# EasyEDA Pro project 数控电源.eprj, board 开关电源1号
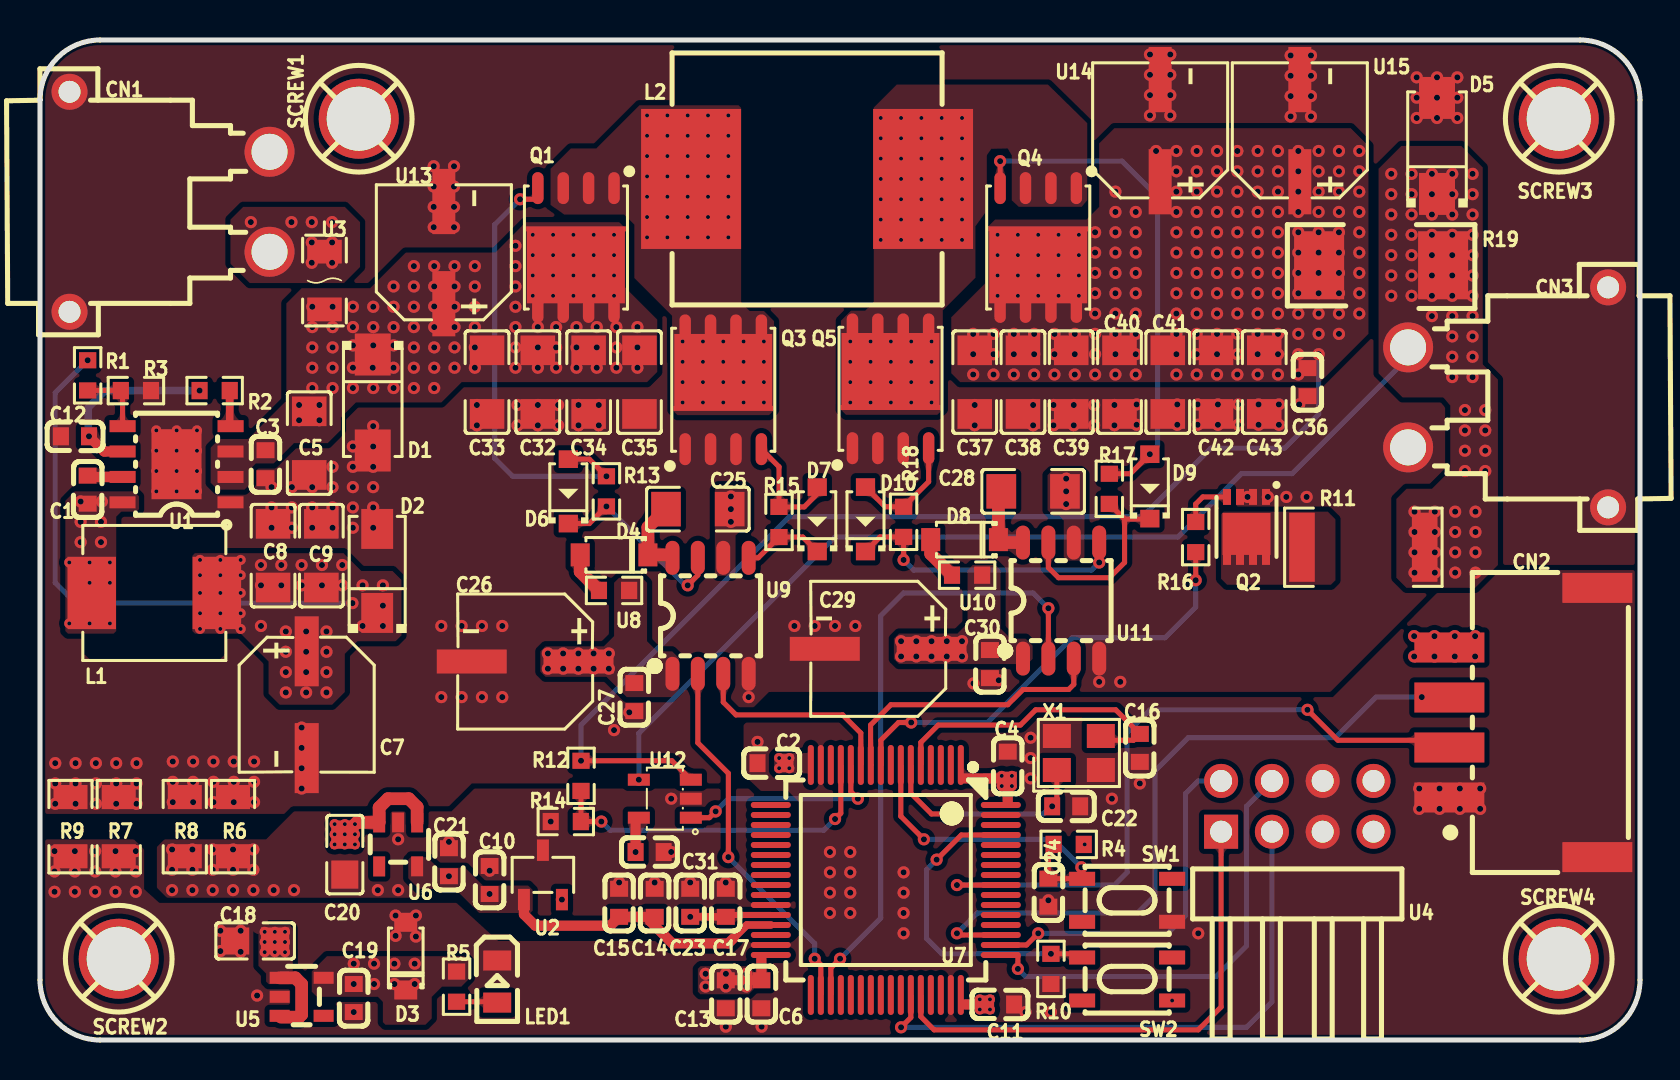
[diagram p2: board, top side]
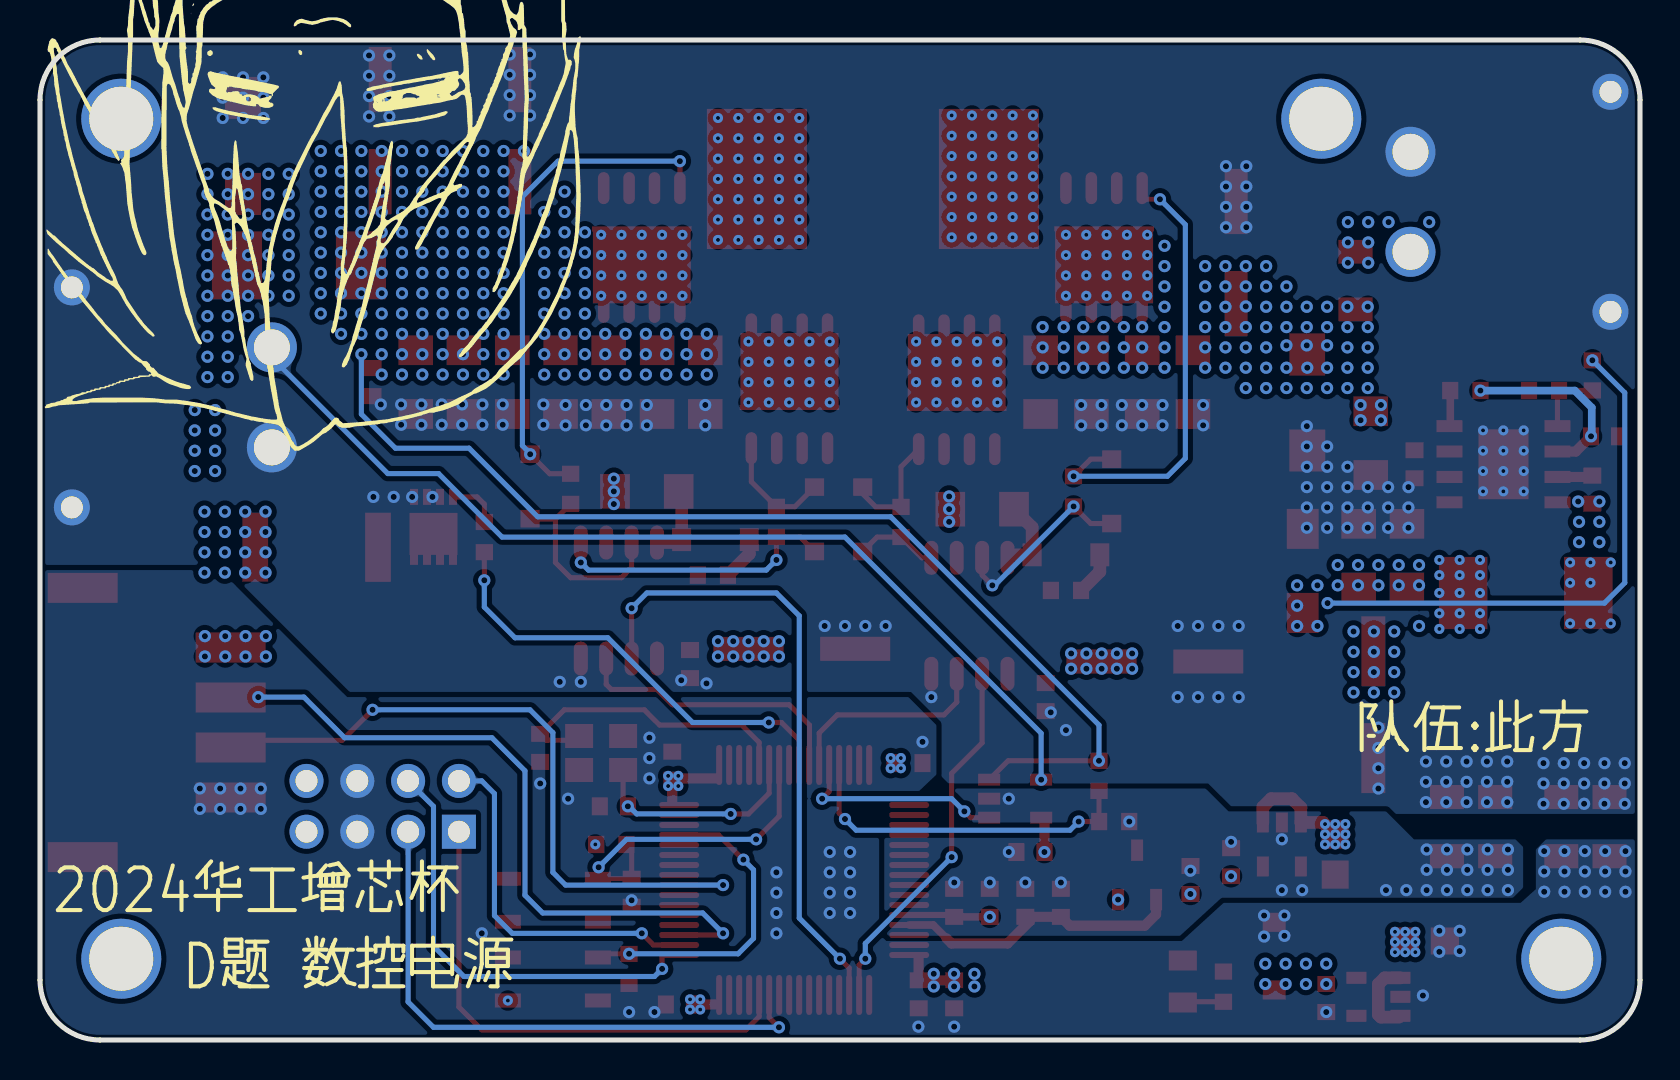
[diagram p3: board, bottom side, seen from below]

Outline 80 x 50 mm; copper layers: Top Layer, Inner1, Inner2, Bottom Layer. Coordinates in mm from the lower left corner of the outline.
Outline path: 0,47 0,3 arc(0.88,0.88) 3,0 77,0 arc(79.12,0.88) 80,3 80,47 arc(79.12,49.12) 77,50 3,50 arc(0.88,49.12) 0,47
Stack: Top Layer 0.035mm 外层铜厚1oz / Inner1 0.0152mm 内层铜厚 / Inner2 0.0152mm 内层铜厚 / Bottom Layer 0.035mm 外层铜厚1oz

## Design rules (mm)
spacing copperThickness1oz (default): track to track 0.102, other pairs 0.152 to 0.3
spacing copperThickness2oz: track to track 0.203, other pairs 0.152 to 0.3
spacing Plane_innerPlane: track to track 0.102, other pairs 0.152 to 0.3
spacing Copper_copperRegion: track to track 0.102, other pairs 0.152 to 0.3
track width copperThickness1oz (default): min 0.127, default 0.254, max 2.54
track width copperThickness2oz: min 0.203, default 0.254, max 2.54
differential pair differentialPair (default): width min 0.127, default 0.254, max 2.54; gap min 0.152, default 0.152

## Placement (name value [footprint] x y rotation side)
C1  100nF  [c0603]  2.38 27.52 270 top
C2  100nF  [c0603]  36.58 13.84 180 top
C3  220nF  [C0603]  11.27 28.79 90 top
C4  100nF  [c0603]  48.39 13.72 90 top
C5  10uF  [C1206]  13.46 29.84 90 top
C6  100nF  [c0603]  36.07 2.29 270 top
C7  47uF  [CAP-SMD_BD6.3-L6.6-W6.6-LS7.2-FD]  13.33 16.76 270 top
C8  22uF  [C1206]  11.65 24.22 270 top
C9  22uF  [C1206]  14.07 24.22 270 top
C10  470nF  [C0603]  22.48 8 270 top
C11  100nF  [c0603]  48.01 1.78 0 top
C12  1uF  [c0603]  1.75 30.19 180 top
C13  4.7uF  [C0603]  34.29 2.29 270 top
C14  10nF  [C0603]  30.73 6.86 90 top
C15  1uF  [c0603]  28.96 6.86 90 top
C16  20pF  [C0603]  54.99 14.61 90 top
C17  100nF  [c0603]  34.29 6.86 90 top
C18  1uF  [C0805]  10.76 4.95 0 top
C19  1uF  [c0603]  15.69 2.1 90 top
C20  1uF  [C0805]  15.24 9.27 90 top
C21  1uF  [c0603]  20.45 8.89 270 top
C22  20pF  [C0603]  51.31 11.68 180 top
C23  1uF  [c0603]  32.51 6.86 90 top
C24  1uF  [c0603]  50.42 7.37 270 top
C25  1uF  [C1206]  32.89 26.54 180 top
C26  47uF  [CAP-SMD_BD6.3-L6.6-W6.6-LS7.2-FD]  24.26 18.92 180 top
C27  100nF  [c0603]  29.72 17.14 90 top
C28  1uF  [C1206]  49.66 27.43 180 top
C29  47uF  [CAP-SMD_BD6.3-L6.6-W6.6-LS7.2-FD]  41.91 19.56 180 top
C30  100nF  [c0603]  47.5 18.8 90 top
C31  100nF  [c0603]  30.48 9.4 0 top
C32  10uF  [C1206]  24.89 32.89 90 top
C33  10uF  [C1206]  22.35 32.89 90 top
C34  10uF  [C1206]  27.43 32.89 90 top
C35  10uF  [C1206]  29.97 32.89 90 top
C36  100nF  [c0603]  63.37 32.89 90 top
C37  10uF  [C1206]  46.74 32.89 90 top
C38  10uF  [C1206]  49.15 32.89 90 top
C39  10uF  [C1206]  51.56 32.89 90 top
C40  10uF  [C1206]  53.97 32.89 90 top
C41  10uF  [C1206]  56.39 32.89 90 top
C42  10uF  [C1206]  58.8 32.89 90 top
C43  10uF  [C1206]  61.21 32.89 90 top
CN1  XT30PW-M  [CONN-TH_XT30PW-M]  6.48 41.91 270 top
CN2  WAFER-XH2.54-4PWB  [CONN-TH_4P-P0.20_XUNPU_WAFER-XH2.54-4PWB]  74.17 15.88 90 top
CN3  XT30PW-M  [CONN-TH_XT30PW-M]  73.41 32.13 90 top
D1  SMAJ13A  [SMA_L4.3-W2.7-LS5.1-RD]  16.64 31.88 270 top
D2  SMAJ5.0A  [SMA_L4.3-W2.5-LS5.0-RD]  16.86 23.45 90 top
D3  SMF3.3A  [SOD-123_L2.8-W1.8-LS3.7-RD]  18.29 4.19 90 top
D4  FR107  [SOD-123_L2.8-W1.8-LS3.7-RD]  28.7 24.26 180 top
D5  SMAJ13A  [SMA_L4.3-W2.7-LS5.1-RD]  69.85 44.7 90 top
D6  1N4148W  [SOD-123_L2.7-W1.6-LS3.7-FD]  26.42 27.43 270 top
D7  1N4148W  [SOD-123_L2.7-W1.6-LS3.7-FD]  38.86 26.03 270 top
D8  FR107  [SOD-123_L2.8-W1.8-LS3.7-RD]  46.23 25.02 180 top
D9  1N4148W  [SOD-123_L2.7-W1.6-LS3.7-FD]  55.49 27.68 270 top
D10  1N4148W  [SOD-123_L2.7-W1.6-LS3.7-FD]  41.28 26.03 270 top
L1  8.2uH  [IND-SMD_L7.0-W6.6_FXL0630]  5.72 22.35 180 top
L2  10uH  [IND-SMD_L12.6-W13.5]  38.35 43.05 0 top
LED1  SZYY0805R  [LED0805-R-RD]  22.86 2.92 270 top
Q1  IRFH8318TRPBF  [PQFN-8_L5.8-W4.9-P1.27-LS6.0-BL-1]  26.8 39.62 180 top
Q2  AON7264E  [DFN-8_L3.0-W3.0-P0.65-BL]  60.32 25.65 180 top
Q3  IRFH8318TRPBF  [PQFN-8_L5.8-W4.9-P1.27-LS6.0-BL-1]  34.16 32.51 0 top
Q4  IRFH8318TRPBF  [PQFN-8_L5.8-W4.9-P1.27-LS6.0-BL-1]  49.91 39.62 180 top
Q5  IRFH8318TRPBF  [PQFN-8_L5.8-W4.9-P1.27-LS6.0-BL-1]  42.53 32.56 0 top
R1  100kΩ  [R0603]  2.38 33.23 90 top
R2  100kΩ  [R0603]  8.73 32.47 0 top
R3  26.1kΩ  [R0603]  4.8 32.47 180 top
R4  10kΩ  [R0603]  51.44 9.78 180 top
R5  10kΩ  [R0603]  20.83 2.67 90 top
R6  0Ω  [R1206]  9.65 10.67 90 top
R7  0Ω  [R1206]  3.94 10.67 270 top
R8  0Ω  [R1206]  7.24 10.67 90 top
R9  0Ω  [R1206]  1.52 10.67 270 top
R10  10kΩ  [R0603]  50.55 3.56 270 top
R11  10Ω  [R2512]  66.17 24.64 0 top
R12  100kΩ  [R0603]  27.05 13.21 90 top
R13  10Ω  [R0603]  28.32 27.43 90 top
R14  20kΩ  [R0603]  26.29 10.92 0 top
R15  10Ω  [R0603]  36.95 25.9 90 top
R16  2.2Ω  [R0603]  57.78 25.15 90 top
R17  10Ω  [R0603]  53.47 27.56 90 top
R18  10Ω  [R0603]  43.18 25.91 90 top
R19  5mΩ  [RES-SMD_L6.4-W3.2-1]  67.06 38.73 0 top
SCREW1  -  [m3螺丝]  16 46 0 top
SCREW2  -  [m3螺丝]  4 4 0 top
SCREW3  -  [m3螺丝]  76 46 0 top
SCREW4  -  [m3螺丝]  76 4 0 top
SW1  K2-1808SN-A3SW-01  [SW-SMD_4P-L4.2-W3.3-P2.15-LS5.1]  54.36 6.98 0 top
SW2  K2-1808SN-A3SW-01  [SW-SMD_4P-L4.2-W3.3-P2.15-LS5.1]  54.36 3.05 180 top
U1  LMR33630ADDAR  [ESOP-8_L4.9-W3.9-P1.27-LS6.0-TL-EP]  6.83 28.79 180 top
U2  REF3025AIDBZR  [SOT-23-3_L2.9-W1.6-P1.90-LS2.8-BR]  25.15 8.25 270 top
U3  0437005.WR  [F1206]  14.22 37.97 90 top
U4  PZ2.54-2*4-WZ  [HDR-TH_8P-P2.54-H-M-R2-C4-S2.54-N]  62.87 11.68 0 top
U5  TLV75733PDBVR  [SOT-23-5_L2.9-W1.6-P0.95-LS2.8-BL]  13.08 2.16 270 top
U6  TPS7A2033PDBVR  [SOT-23-5_L2.9-W1.6-P0.95-LS2.8-BR]  17.91 9.78 90 top
U7  STM32G474RBT6  [LQFP-64_L10.0-W10.0-P0.50-LS12.0-BL]  42.29 8 180 top
U8  3.3Ω  [R0603]  28.7 22.48 180 top
U9  EG2104  [SOP-8_L5.0-W4.0-P1.27-LS6.2-BL]  33.53 21.21 0 top
U10  3.3Ω  [R0603]  46.35 23.24 180 top
U11  EG2104  [SOP-8_L5.0-W4.0-P1.27-LS6.2-BL]  51.05 21.97 0 top
U12  INA180A4IDBVR  [SOT-23-5_L3.0-W1.7-P0.95-LS2.8-BR]  31.24 12.06 0 top
U13  220uF  [CAP-SMD_BD6.3-L6.6-W6.6-LS7.2-R-RD]  20.19 39.37 270 top
U14  220uF  [CAP-SMD_BD6.3-L6.6-W6.6-LS7.2-R-RD]  56.01 45.47 270 top
U15  220uF  [CAP-SMD_BD6.3-L6.6-W6.6-LS7.2-R-RD]  62.99 45.47 270 top
X1  25MHz  [CRYSTAL-SMD_4P-L3.2-W2.5-BL]  51.94 14.35 0 top

## Footprints (pads in the part's own frame, mm; a bottom-side part is the same pattern mirrored in y, then rotated)
c0603
  rect 0.8x0.899 smd: 1(-0.701,0) 2(0.701,0)
C0603
  rect 0.8x0.9 smd: 1(-0.7,0) 2(0.7,0)
C0805
  rect 1.41x1.35 smd: 1(-1,0) 2(1,0)
C1206
  rect 1.485x1.728 smd: 1(-1.593,0) 2(1.593,0)
CAP-SMD_BD6.3-L6.6-W6.6-LS7.2-FD
  rect 3.5x1.2 smd: 1(-2.67,0) 2(2.67,0)
CAP-SMD_BD6.3-L6.6-W6.6-LS7.2-R-RD
  rect 3.26x1.15 smd: 1(2.555,0) 2(-2.555,0)
CONN-TH_4P-P0.20_XUNPU_WAFER-XH2.54-4PWB
  rect 1.5x3.5 smd: 1(-3.75,3.7) 2(-1.25,3.7) 3(1.25,3.7) 4(3.75,3.7) 5(-6.73,-3.7) 6(6.73,-3.7)
CONN-TH_XT30PW-M
  round 2.5 hole 1.8: 1(-2.5,5) 2(2.5,5)
  round 1.8 hole 1.1: 3(5.5,-5) 4(-5.5,-5)
CRYSTAL-SMD_4P-L3.2-W2.5-BL
  rect 1.4x1.2 smd: 1(-1.1,-0.85) 2(1.1,-0.85) 3(1.1,0.85) 4(-1.1,0.85)
DFN-8_L3.0-W3.0-P0.65-BL
  rect 0.4x0.8 smd: 1(-0.975,-1.5) 2(-0.325,-1.5) 3(0.325,-1.5) 4(0.975,-1.5) 5(0.975,1.5) 6(0.325,1.5) 7(-0.325,1.5) 8(-0.975,1.5)
  rect 2.4x2.1 smd: 9(0,0.35)
ESOP-8_L4.9-W3.9-P1.27-LS6.0-TL-EP
  rect 1.3x0.6 smd: 1(-2.7,1.905) 2(-2.7,0.635) 3(-2.7,-0.635) 4(-2.7,-1.905) 5(2.7,-1.905) 6(2.7,-0.635) 7(2.7,0.635) 8(2.7,1.905)
  rect 2.5x3.5 smd: 9(0,0)
F1206
  rect 1.19x1.728 smd: 1(-1.445,0) 2(1.445,0)
HDR-TH_8P-P2.54-H-M-R2-C4-S2.54-N
  rect 1.7x1.7 hole 1.1: 1(-3.81,-1.27)
  round 1.7 hole 1.1: 2(-3.81,1.27) 3(-1.27,-1.27) 4(-1.27,1.27) 5(1.27,-1.27) 6(1.27,1.27) 7(3.81,-1.27) 8(3.81,1.27)
IND-SMD_L7.0-W6.6_FXL0630
  rect 2.424x3.62 smd: 1(3.128,0) 2(-3.128,0)
IND-SMD_L12.6-W13.5
  rect 5x7 smd: 1(-5.8,0) 2(5.8,0)
LED0805-R-RD
  rect 1x1.399 smd: 1(1.05,0) 2(-1.05,0)
LQFP-64_L10.0-W10.0-P0.50-LS12.0-BL
  oval 0.3x2 smd: 1(-3.75,-5.75) 2(-3.25,-5.75) 3(-2.75,-5.75) 4(-2.25,-5.75) 5(-1.75,-5.75) 6(-1.25,-5.75) 7(-0.75,-5.75) 8(-0.25,-5.75) 9(0.25,-5.75) 10(0.75,-5.75) 11(1.25,-5.75) 12(1.75,-5.75) 13(2.25,-5.75) 14(2.75,-5.75) 15(3.25,-5.75) 16(3.75,-5.75) 33(3.75,5.75) 34(3.25,5.75) 35(2.75,5.75) 36(2.25,5.75) 37(1.75,5.75) 38(1.25,5.75) 39(0.75,5.75) 40(0.25,5.75) 41(-0.25,5.75) 42(-0.75,5.75) 43(-1.25,5.75) 44(-1.75,5.75) 45(-2.25,5.75) 46(-2.75,5.75) 47(-3.25,5.75) 48(-3.75,5.75)
  oval 2x0.3 smd: 17(5.75,-3.75) 18(5.75,-3.25) 19(5.75,-2.75) 20(5.75,-2.25) 21(5.75,-1.75) 22(5.75,-1.25) 23(5.75,-0.75) 24(5.75,-0.25) 25(5.75,0.25) 26(5.75,0.75) 27(5.75,1.25) 28(5.75,1.75) 29(5.75,2.25) 30(5.75,2.75) 31(5.75,3.25) 32(5.75,3.75) 49(-5.75,3.75) 50(-5.75,3.25) 51(-5.75,2.75) 52(-5.75,2.25) 53(-5.75,1.75) 54(-5.75,1.25) 55(-5.75,0.75) 56(-5.75,0.25) 57(-5.75,-0.25) 58(-5.75,-0.75) 59(-5.75,-1.25) 60(-5.75,-1.75) 61(-5.75,-2.25) 62(-5.75,-2.75) 63(-5.75,-3.25) 64(-5.75,-3.75)
m3螺丝
  round 4 hole 3.2: 1(-0.064,0.064)
PQFN-8_L5.8-W4.9-P1.27-LS6.0-BL-1
  oval 0.574x1.6 smd: 1(-1.905,-2.97) 2(-0.635,-2.97) 3(0.635,-2.97) 4(1.905,-2.97) 5(1.905,2.97) 6(0.635,2.97) 7(-0.635,2.97) 8(-1.905,2.97)
  custom 4.981x3.851 smd: 9(0.001,0.865)
R0603
  rect 0.806x0.864 smd: 1(-0.753,0) 2(0.753,0)
R1206
  rect 1.208x1.701 smd: 1(-1.479,0) 2(1.479,0)
R2512
  rect 1.282x3.456 smd: 1(-3.067,0) 2(3.067,0)
RES-SMD_L6.4-W3.2-1
  rect 2.5x3.4 smd: 1(-3.1,0) 2(3.1,0)
SMA_L4.3-W2.5-LS5.0-RD
  rect 2x1.593 smd: 1(-2.1,0) 2(2.1,0)
SMA_L4.3-W2.7-LS5.1-RD
  rect 2.1x1.8 smd: 1(-2.4,0) 2(2.4,0)
SOD-123_L2.7-W1.6-LS3.7-FD
  rect 0.88x0.96 smd: 1(-1.61,0) 2(1.61,0)
SOD-123_L2.8-W1.8-LS3.7-RD
  rect 0.95x1.15 smd: 1(-1.692,0) 2(1.692,0)
SOP-8_L5.0-W4.0-P1.27-LS6.2-BL
  oval 0.7x1.7 smd: 1(-1.905,-2.9) 2(-0.635,-2.9) 3(0.635,-2.9) 4(1.905,-2.9) 5(1.905,2.9) 6(0.635,2.9) 7(-0.635,2.9) 8(-1.905,2.9)
SOT-23-3_L2.9-W1.6-P1.90-LS2.8-BR
  rect 1.07x0.6 smd: 1(1.235,-0.95) 2(1.235,0.95) 3(-1.235,0)
SOT-23-5_L2.9-W1.6-P0.95-LS2.8-BL
  rect 0.6x1 smd: 1(-0.95,-1.1) 2(0,-1.1) 3(0.95,-1.1) 4(0.95,1.1) 5(-0.95,1.1)
SOT-23-5_L2.9-W1.6-P0.95-LS2.8-BR
  rect 1x0.6 smd: 1(1.1,-0.95) 2(1.1,0) 3(1.1,0.95) 4(-1.1,0.95) 5(-1.1,-0.95)
SOT-23-5_L3.0-W1.7-P0.95-LS2.8-BR
  rect 1.1x0.6 smd: 1(1.3,-0.95) 2(1.3,0) 3(1.3,0.95) 4(-1.3,0.95) 5(-1.3,-0.95)
SW-SMD_4P-L4.2-W3.3-P2.15-LS5.1
  rect 1.3x0.7 smd: 1(-2.25,1.075) 2(2.25,1.075) 3(-2.25,-1.075) 4(2.25,-1.075)

## Nets
As in the schematic.

Pads without a net: SCREW1 1; SCREW2 1; SCREW3 1; SCREW4 1; SW1 2 3; SW2 2 3; U5 4; U6 4; U7 2 3 4 8 14 17 18 19 20 21 22 23 24 25 26 30 33 36 37 38 39 40 41 42 45 46 52 53 54 55 57 58 59 60 62

## Via types
v1: diameter 0.61, hole 0.305, Top Layer to Bottom Layer, 680 vias
v2: diameter 0.505, hole 0.201, Top Layer to Bottom Layer, 217 vias

## Routing (per net, layer and track width the routed paths; a pad name or vN(x,y) marks a point on that pad's centre or on a via; arc(x,y) is an arc through that point)
2V5A: length 10.8
  Top Layer w0.305: 34.29,6.16 34.38,6.25 U7.28
  Top Layer w0.381: v1(32.51,6.16) 34.29,6.16
  Inner2 w0.381: 26.16,6.98 31.68,6.98 v1(32.51,6.16)
  vias: v1(26.1,7.02)
3V3: length 39.5
  Top Layer w0.508: C13.1 36.07,2.99 ; 46.15,13.08 48.32,13.08 C4.1 48.39,11.94 ; C11.1 46.23,1.78 ; C6.1 36.07,4.06
  Inner2 w0.508: v2(52.24,9.78) 47.37,9.78 ; v2(46.99,2.03) 47.24,2.29 56.29,2.29 v2(56.61,1.97) 64.97,1.97 66.68,3.68 U4.7
  vias: v1(15.69,3.81) v1(15.69,2.8) v1(16.7,3.81) v1(16.7,2.8) v1(17.72,3.81) v1(17.72,2.8) v1(18.74,3.81) v1(18.74,2.8) v1(33.28,3.31) v1(33.28,2.68) v1(34.3,3.31) v1(34.3,2.68) v1(35.31,3.31) v1(35.31,2.68) v2(36.96,14.1) v2(36.96,13.59) v2(37.47,14.1) v2(37.47,13.59) v2(46.99,1.52) v2(47.5,2.03) v2(47.5,1.52) v2(48.09,13.21) v2(48.09,12.7) v2(48.59,13.21) v2(48.59,12.7)
3V3A: length 26.4
  Top Layer w0.381: 34.67,5.08 35.34,5.75 U7.29
  Top Layer w0.508: 34.67,5.08 34.42,4.83 31.62,4.83 30.51,5.94 30.73,6.16 28.96,6.16 28.51,5.72 24.76,5.72 24.2,6.28 U2.1 ; v1(29.78,9.4) 29.78,10.95 U12.5
  Inner2 w0.508: v1(20.45,8.19) 21.66,9.4 29.72,9.4
  vias: v1(22.48,7.3)
4V8: length 99.9
  Top Layer w0.635: C20.2 15.85,10.88 16.96,10.88 16.96,11.62 17.4,12.06 18.44,12.06 18.86,11.65 18.86,10.88 ; 12.05,1.14 12.95,1.14 13.08,1.27 13.08,2.79 12.77,3.11 11.98,3.11
  Inner2 w1.27: 66.68,19.56 43.05,19.56 42.42,18.92 15.62,18.92 ; 66.68,19.56 72.01,19.56 ; 66.68,19.56 U4.8
  Bottom Layer w0.254: v1(15.62,21.84) 1.78,21.84 0.76,22.86 0.76,32.37 v1(2.38,33.99)
  vias: v1(11.05,23.75) v1(11.05,22.73) v1(11.05,20.7) v1(12.06,23.75) v1(12.06,22.73) v1(12.29,20.43) v1(12.29,19.41) v1(12.29,18.39) v1(12.29,17.38) v1(13.08,23.75) v1(13.08,22.73) v1(13.31,20.43) v1(13.31,19.41) v1(13.31,18.39) v1(13.31,17.38) v1(14.1,23.75) v1(14.1,22.73) v1(14.32,20.43) v1(14.32,19.41) v1(14.32,18.39) v1(14.32,17.38) v1(15.11,23.75) v1(15.11,22.73) v1(16.13,22.73) v1(16.13,20.7) v1(17.14,22.73) v1(17.14,21.72) v1(17.14,20.7) v1(25.39,19.33) v1(25.39,18.56) v1(26.16,19.33) v1(26.16,18.56) v1(26.92,19.33) v1(26.92,18.56) v1(27.68,19.33) v1(27.68,18.56) v1(28.44,19.33) v1(28.44,18.56) v1(43.05,19.94) v1(43.05,19.18) v1(43.81,19.94) v1(43.81,19.18) v1(44.58,19.94) v1(44.58,19.18) v1(45.34,19.94) v1(45.34,19.18) v1(46.1,19.94) v1(46.1,19.18) v1(68.71,20.19) v1(68.71,19.18) v1(69.72,20.19) v1(69.72,19.18) v1(70.74,20.19) v1(70.74,19.18) v1(71.75,20.19) v1(71.75,19.18) v2(8,24) v2(8,23.24) v2(8,22.35) v2(8,21.34) v2(8,20.55) v2(9.02,24) v2(9.02,23.24) v2(9.02,22.35) v2(9.02,21.34) v2(9.02,20.55) v2(10.03,24) v2(10.03,23.24) v2(10.03,22.35) v2(10.03,21.34) v2(10.03,20.55) v2(11.23,5.41) v2(11.23,4.9) v2(11.23,4.39) v2(11.74,5.41) v2(11.74,4.9) v2(11.74,4.39) v2(12.25,5.41) v2(12.25,4.9) v2(12.25,4.39) v2(14.73,10.8) v2(14.73,10.29) v2(14.73,9.78) v2(15.24,10.8) v2(15.24,10.29) v2(15.24,9.78) v2(15.75,10.8) v2(15.75,10.29) v2(15.75,9.78)
AGND:
  vias: v1(6.6,9.53) v1(6.6,8.51) v1(6.6,7.49) v1(7.62,9.53) v1(7.62,8.51) v1(7.62,7.49) v1(8.64,9.53) v1(8.64,8.51) v1(8.64,7.49) v1(9.65,9.53) v1(9.65,8.51) v1(9.65,7.49) v1(10.67,9.53) v1(10.67,8.51) v1(10.67,7.49) v1(11.68,7.49) v1(12.7,7.49) v1(16.89,7.49) v1(17.91,10.03) v1(17.91,7.49) v1(20.45,9.91) v1(22.48,8.46) v1(25.54,10.92) v1(28.96,7.87) v1(30.73,7.87) v1(31.56,12.06) v1(31.56,9.4) v1(32.51,7.87) v1(34.29,7.87)
GND:
  vias: v1(0.73,9.44) v1(0.73,8.43) v1(0.73,7.41) v1(1.74,9.44) v1(1.74,8.43) v1(1.74,7.41) v1(2.76,9.44) v1(2.76,8.43) v1(2.76,7.41) v1(3.77,9.44) v1(3.77,8.43) v1(3.77,7.41) v1(4.79,9.44) v1(4.79,8.43) v1(4.79,7.41) v1(9.02,5.46) v1(9.02,4.44) v1(10.03,5.46) v1(10.03,4.41) v1(10.85,2.22) v1(15.69,1.4) v1(17.78,6.22) v1(17.78,5.21) v1(18.8,6.22) v1(18.8,5.17) v1(34.29,0.67) v1(35.88,14.91) v1(36.08,0.67) v1(39.5,9.4) v1(39.5,8.38) v1(39.5,7.37) v1(39.5,6.35) v1(40.51,9.4) v1(40.51,8.38) v1(40.51,7.37) v1(40.51,6.35) v1(43.18,8.38) v1(43.18,7.37) v1(43.18,6.35) v1(43.18,5.33) v1(49.28,1.4) v1(49.53,15.11) v1(49.53,14.1) v1(49.53,13.08) v1(50.42,6.98) v1(50.55,1.4) v1(53.59,12.06) v1(54.99,12.83) v1(57.91,5.33) v1(68.96,12.57) v1(68.96,11.56) v1(69.98,12.57) v1(69.98,11.56) v1(70.99,12.57) v1(70.99,11.56) v1(72.01,12.57) v1(72.01,11.56)
PGND:
  vias: v1(0.76,13.84) v1(0.76,12.83) v1(0.76,11.81) v1(1.78,13.84) v1(1.78,12.83) v1(1.78,11.81) v1(2.79,13.84) v1(2.79,12.83) v1(2.79,11.81) v1(3.81,13.84) v1(3.81,12.83) v1(3.81,11.81) v1(4.83,13.84) v1(4.83,12.83) v1(4.83,11.81) v1(6.64,13.92) v1(6.64,12.91) v1(6.64,11.89) v1(7.66,13.92) v1(7.66,12.91) v1(7.66,11.89) v1(8.67,13.92) v1(8.67,12.91) v1(8.67,11.89) v1(9.69,13.92) v1(9.69,12.91) v1(9.69,11.89) v1(10.7,13.92) v1(10.7,12.91) v1(10.7,11.89) v1(11.58,27.64) v1(11.58,26.63) v1(11.58,25.61) v1(12.59,27.64) v1(12.59,26.63) v1(12.59,25.61) v1(13.08,15.62) v1(13.08,14.61) v1(13.08,13.59) v1(13.08,12.57) v1(13.61,27.64) v1(13.61,26.63) v1(13.61,25.61) v1(14.63,28.66) v1(14.63,27.64) v1(14.63,26.63) v1(14.63,25.61) v1(15.64,29.68) v1(15.64,28.66) v1(15.64,27.64) v1(15.64,26.63) v1(15.64,25.61) v1(16.66,30.69) v1(16.66,29.68) v1(16.66,28.66) v1(16.66,27.64) v1(16.66,26.63) v1(16.66,25.61) v1(19.69,43.69) v1(19.69,42.67) v1(19.69,41.66) v1(19.69,40.64) v1(20.07,20.7) v1(20.07,17.14) v1(20.7,43.69) v1(20.7,42.67) v1(20.7,41.66) v1(20.7,40.64) v1(21.08,20.7) v1(21.08,17.14) v1(21.84,31.75) v1(21.84,30.73) v1(22.1,20.7) v1(22.1,17.14) v1(23.11,20.7) v1(23.11,17.14) v1(23.88,31.75) v1(23.88,30.73) v1(24.89,31.75) v1(24.89,30.73) v1(25.91,31.75) v1(25.91,30.73) v1(26.92,31.75) v1(26.92,30.73) v1(27.94,31.75) v1(27.94,30.73) v1(28.7,15.49) v1(29.46,16.38) v1(35.43,17.14) v1(37.72,20.7) v1(38.74,20.7) v1(39.75,20.7) v1(40.77,20.7) v1(46.74,31.75) v1(46.74,30.73) v1(46.68,17.83) v1(47.94,17.99) v1(49.66,31.75) v1(49.66,30.73) v1(50.67,31.75) v1(50.67,30.73) v1(51.69,31.75) v1(51.69,30.73) v1(52.71,31.75) v1(52.71,30.73) v1(52.96,17.91) v1(53.72,31.75) v1(53.72,30.73) v1(54.01,17.91) v1(54.83,31.78) v1(54.83,30.76) v1(55.5,49.28) v1(55.5,48.26) v1(55.5,47.24) v1(55.5,46.23) v1(56.51,49.28) v1(56.51,48.26) v1(56.51,47.24) v1(56.51,46.23) v1(56.86,31.78) v1(56.86,30.76) v1(57.88,31.78) v1(57.88,30.76) v1(58.9,31.78) v1(58.9,30.76) v1(59.91,31.78) v1(59.91,30.76) v1(60.38,27.15) v1(60.93,31.78) v1(60.93,30.76) v1(61.39,27.15) v1(61.94,31.78) v1(61.94,30.76) v1(62.32,27.15) v1(62.53,49.23) v1(62.53,48.21) v1(62.53,47.19) v1(62.53,46.18) v1(62.96,31.78) v1(63.33,27.15) v1(63.55,49.23) v1(63.55,48.21) v1(63.55,47.19) v1(63.55,46.18) v1(68.83,48.13) v1(68.83,47.12) v1(68.83,46.1) v1(69.85,48.13) v1(69.85,47.12) v1(69.85,46.1) v1(70.87,48.13) v1(70.87,47.12) v1(70.87,46.1) v2(5.82,30.48) v2(5.82,29.46) v2(5.82,28.45) v2(5.82,27.43) v2(6.83,30.48) v2(6.83,29.46) v2(6.83,28.45) v2(6.83,27.43) v2(7.85,30.48) v2(7.85,29.46) v2(7.85,28.45) v2(7.85,27.43)
VIN:
  vias: v1(12.95,31.75) v1(12.95,30.99) v1(13.61,36.66) v1(13.61,35.65) v1(13.61,34.63) v1(13.61,33.61) v1(13.61,32.6) v1(13.97,31.75) v1(13.97,30.99) v1(14.63,36.66) v1(14.63,35.65) v1(14.63,34.63) v1(14.63,33.61) v1(14.63,32.6) v1(15.65,36.66) v1(15.65,35.65) v1(15.65,34.73) v1(15.65,33.61) v1(15.65,32.6) v1(16.64,33.61) v1(16.66,36.66) v1(16.66,35.65) v1(16.66,34.73) v1(16.66,32.6) v1(17.68,37.68) v1(17.68,36.66) v1(17.68,35.65) v1(17.68,34.73) v1(17.68,33.61) v1(17.68,32.6) v1(18.69,38.69) v1(18.69,37.68) v1(18.69,36.66) v1(18.69,35.65) v1(18.69,34.63) v1(18.69,33.61) v1(18.69,32.6) v1(19.71,38.69) v1(19.71,37.68) v1(19.71,36.68) v1(19.71,35.65) v1(19.71,34.63) v1(19.71,33.61) v1(19.71,32.6) v1(20.73,38.69) v1(20.73,37.68) v1(20.73,36.66) v1(20.73,35.65) v1(20.73,34.63) v1(20.73,33.61) v1(21.74,38.69) v1(21.74,37.68) v1(21.74,36.66) v1(21.74,35.65) v1(21.74,34.63) v1(21.74,33.61) v1(23.77,39.71) v1(23.77,38.69) v1(23.77,37.68) v1(23.77,36.66) v1(23.77,35.65) v1(23.77,34.63) v1(23.77,33.61) v1(24.89,35.65) v1(24.89,34.63) v1(24.89,33.61) v1(25.81,35.65) v1(25.81,34.63) v1(25.81,33.61) v1(26.82,35.65) v1(26.82,34.63) v1(26.82,33.61) v1(27.84,35.65) v1(27.84,34.63) v1(27.84,33.61) v1(28.82,35.65) v1(28.82,34.63) v1(28.82,33.61) v1(29.87,35.65) v1(29.87,34.63) v1(29.87,33.61) v2(24.64,40.26) v2(24.64,39.24) v2(24.64,38.23) v2(24.64,37.21) v2(25.65,40.26) v2(25.65,39.24) v2(25.65,38.23) v2(25.65,37.21) v2(26.67,40.26) v2(26.67,39.24) v2(26.67,38.23) v2(26.67,37.21) v2(27.69,40.26) v2(27.69,39.24) v2(27.69,38.23) v2(27.69,37.21) v2(28.7,40.26) v2(28.7,39.24) v2(28.7,38.23) v2(28.7,37.21)
ADC2_IN1: length 10.6
  Top Layer w0.254: v1(33.78,11.43) 33.47,11.11 U12.1 ; U7.12 40.54,12.42 v1(40.89,12.06)
  Bottom Layer w0.254: v1(33.78,11.43) 34.42,12.06 v1(40.89,12.06)
BOOT0: length 16
  Top Layer w0.254: U7.61 46.06,10.25 v1(44.83,9.02) ; v1(50.55,4.31) 51.92,4.31 SW2.4
  Bottom Layer w0.254: v1(50.55,4.31) 45.09,4.31 44.32,5.08 44.32,8.51 v1(44.83,9.02)
MOSCTRL: length 22.5
  Top Layer w0.254: U7.9 42.04,14.99 42.93,15.88 v1(43.56,15.88) ; R16.1 v1(57.78,22.99)
  Bottom Layer w0.254: v1(57.78,22.99) 57.78,21.65 56.25,20.11 51.61,20.11 47.37,15.88 v1(43.56,15.88)
OPAMP1: length 17.5
  Top Layer w0.254: 27.05,10.93 R12.1 ; 27.05,10.93 R14.2 ; 27.05,10.93 27.06,10.92 v1(28.07,10.92) ; v1(39.75,11.05) 40.04,11.34 U7.13
  Bottom Layer w0.254: v1(28.07,10.92) 28.5,10.49 39.19,10.49 v1(39.75,11.05)
OSC_IN: length 15.4
  Top Layer w0.254: X1.3 53.26,14.99 54.67,14.99 C16.2 53.79,16.51 49.78,16.51 49.02,15.75 44.91,15.75 44.04,14.88 U7.5
OSC_OUT: length 10.9
  Top Layer w0.254: v1(50.61,11.68) 50.84,11.92 X1.1 ; v1(45.47,11.3) 44.58,11.3 43.54,12.34 U7.6
  Bottom Layer w0.254: v1(45.47,11.3) 50.16,11.3 50.55,11.68
PWM1: length 18.6
  Top Layer w0.254: U9.2 32.89,14.86 34.42,13.33 v1(34.42,9.14) ; U7.34 39.04,3.76 v1(38.74,4.06)
  Bottom Layer w0.254: v1(38.74,4.06) 38.74,4.83 v1(34.42,9.14)
PWM2: length 31.7
  Top Layer w0.254: v1(40,4.06) 39.54,3.6 U7.35 ; v1(50.42,21.59) U11.2
  Bottom Layer w0.254: v1(50.42,21.59) 49.66,22.35 43.18,22.35 42.04,21.21 42.04,6.1 v1(40,4.06)
RST: length 16.2
  Top Layer w0.254: v1(44.2,10.03) 43.04,11.19 U7.7 ; SW1.1 52.1,8.07 C24.1 50.42,9.52 R4.2
  Bottom Layer w0.254: v1(44.2,10.03) 50.67,10.03 v1(52.07,8.64)
SD1: length 10.5
  Top Layer w0.254: U7.11 41.04,15.35 40.13,16.26 34.8,16.26 34.16,16.89 34.16,18.31
SD2: length 14.3
  Top Layer w0.254: U7.10 41.53,13.76 41.53,15.75 42.54,16.76 48.39,16.76 49.15,17.53 51.44,17.53 51.69,17.78 U11.3
SWCLK: length 18
  Top Layer w0.254: U7.50 49.33,4.75 v1(49.91,5.33)
  Bottom Layer w0.254: v1(49.91,5.33) 56.39,5.33 57.28,6.22 57.28,12.32 57.91,12.95 U4.2
SWDIO: length 21.7
  Top Layer w0.254: v1(48.9,3.56) 48.9,4.17 48.82,4.25
  Bottom Layer w0.254: U4.4 60.32,11.68 60.32,4.7 58.8,3.17 49.28,3.17 v1(48.9,3.56)
USART1_RX: length 25.6
  Top Layer w0.254: U7.44 44.04,1.17 44.7,0.51 57.91,0.51 59.06,1.65 U4.1
USART1_TX: length 29.4
  Top Layer w0.254: v1(43.05,0.63) 43.54,1.12 U7.43
  Bottom Layer w0.254: v1(43.05,0.63) 60.32,0.63 61.59,1.91 U4.3
USART2_RX: length 34
  Top Layer w0.254: U7.51 45.93,5.25 v1(45.85,5.33)
  Bottom Layer w0.254: v1(45.85,5.33) 46.86,6.35 54.86,6.35 55.75,7.24 55.75,13.46 57.4,15.11 64.77,15.11 66.8,17.14 v1(69.09,17.14)
USART2_TX: length 35.3
  Top Layer w0.254: v1(63.37,16.51) 64.9,14.99 70.11,14.99 CN2.2 ; U7.56 48.04,7.75 v1(45.85,7.75)
  Bottom Layer w0.254: v1(63.37,16.51) 55.5,16.51 54.36,15.37 54.36,8.38 53.72,7.75 v1(45.85,7.75)
VLOAD: length 49.1
  Bottom Layer w0.254: v1(29.94,13.02) 29.94,15.34 39.75,25.15 56.9,25.15 60.07,28.32 62.61,28.32 68.41,34.12 CN3.2
  vias: v1(67.56,43.31) v1(67.56,42.29) v1(67.56,41.28) v1(67.56,40.26) v1(67.56,39.24) v1(67.56,38.23) v1(67.56,37.21) v1(68.58,43.31) v1(68.58,42.29) v1(68.58,41.28) v1(68.58,40.26) v1(68.58,39.24) v1(68.58,38.23) v1(68.58,37.21) v1(68.73,26.42) v1(68.73,25.4) v1(68.73,24.38) v1(68.73,23.37) v1(69.6,43.31) v1(69.6,42.29) v1(69.6,41.28) v1(69.6,40.26) v1(69.6,39.24) v1(69.6,38.23) v1(69.6,37.21) v1(69.6,36.19) v1(69.74,26.42) v1(69.74,25.4) v1(69.74,24.38) v1(69.74,23.37) v1(70.61,43.31) v1(70.61,42.29) v1(70.61,41.28) v1(70.61,40.26) v1(70.61,39.24) v1(70.61,38.23) v1(70.61,37.21) v1(70.61,36.19) v1(70.61,35.18) v1(70.61,34.16) v1(70.61,33.15) v1(70.76,26.42) v1(70.76,25.4) v1(70.76,24.38) v1(70.76,23.37) v1(71.25,31.5) v1(71.25,30.48) v1(71.25,29.46) v1(71.25,28.45) v1(71.63,43.31) v1(71.63,42.29) v1(71.63,41.28) v1(71.63,40.26) v1(71.63,39.24) v1(71.63,38.23) v1(71.63,37.21) v1(71.63,36.19) v1(71.63,35.18) v1(71.63,34.16) v1(71.63,33.15) v1(71.77,26.42) v1(71.77,25.4) v1(71.77,24.38) v1(71.77,23.37) v1(72.26,31.5) v1(72.26,30.48) v1(72.26,29.46) v1(72.26,28.45)
VOUT: length 54
  Top Layer w0.254: U12.3 31.6,13.96 v1(27.05,13.96)
  Bottom Layer w0.254: v1(63.93,34.29) 63.93,31.29 62.23,29.59 58.55,29.59 55.12,26.16 37.47,26.16 27.05,15.75 27.05,13.97
  vias: v1(46.66,35.31) v1(46.66,34.29) v1(46.66,33.27) v1(47.68,35.31) v1(47.68,34.29) v1(47.68,33.27) v1(48.69,35.31) v1(48.69,34.29) v1(48.69,33.27) v1(49.71,35.31) v1(49.71,34.29) v1(49.71,33.27) v1(50.72,35.31) v1(50.72,34.29) v1(50.72,33.27) v1(51.74,35.31) v1(51.74,34.29) v1(51.74,33.27) v1(52.76,40.39) v1(52.76,39.37) v1(52.76,38.35) v1(52.76,37.34) v1(52.76,36.32) v1(52.76,35.31) v1(52.76,34.29) v1(52.76,33.27) v1(53.77,42.42) v1(53.77,41.4) v1(53.77,40.39) v1(53.77,39.37) v1(53.77,38.35) v1(53.77,37.34) v1(53.77,36.32) v1(53.77,35.31) v1(53.77,34.29) v1(53.77,33.27) v1(54.79,41.4) v1(54.79,40.39) v1(54.79,39.37) v1(54.79,38.35) v1(54.79,37.34) v1(54.79,36.32) v1(54.79,35.31) v1(54.79,34.29) v1(54.79,33.27) v1(55.8,44.45) v1(56.82,44.45) v1(56.82,43.43) v1(56.82,42.42) v1(56.82,41.4) v1(56.82,40.39) v1(56.82,39.37) v1(56.82,38.35) v1(56.82,37.34) v1(56.82,36.32) v1(56.82,35.31) v1(56.82,34.29) v1(56.82,33.27) v1(57.84,44.45) v1(57.84,43.43) v1(57.84,42.42) v1(57.84,41.4) v1(57.84,40.39) v1(57.84,39.37) v1(57.84,38.35) v1(57.84,37.34) v1(57.84,36.32) v1(57.84,35.31) v1(57.84,34.29) v1(57.84,33.27) v1(58.85,44.45) v1(58.85,43.43) v1(58.85,42.42) v1(58.85,41.4) v1(58.85,40.39) v1(58.85,39.37) v1(58.85,38.35) v1(58.85,37.34) v1(58.85,36.32) v1(58.85,35.31) v1(58.85,34.29) v1(58.85,33.27) v1(59.87,44.45) v1(59.87,43.43) v1(59.87,42.42) v1(59.87,41.4) v1(59.87,40.39) v1(59.87,39.37) v1(59.87,38.35) v1(59.87,37.34) v1(59.87,36.32) v1(59.87,35.31) v1(59.87,34.29) v1(59.87,33.27) v1(60.88,44.45) v1(60.88,43.43) v1(60.88,42.42) v1(60.88,41.4) v1(60.88,40.39) v1(60.88,39.37) v1(60.88,38.35) v1(60.88,37.34) v1(60.88,36.32) v1(60.88,35.31) v1(60.88,34.29) v1(60.88,33.27) v1(61.9,44.45) v1(61.9,43.43) v1(61.9,42.42) v1(61.9,41.4) v1(61.9,40.39) v1(61.9,39.37) v1(61.9,38.35) v1(61.9,37.34) v1(61.9,36.32) v1(61.9,35.31) v1(61.9,34.29) v1(61.9,33.27) v1(62.92,44.45) v1(62.92,43.43) v1(62.92,42.42) v1(62.92,41.4) v1(62.92,40.39) v1(62.92,39.37) v1(62.92,38.35) v1(62.92,37.34) v1(62.92,36.32) v1(62.92,35.31) v1(62.92,34.29) v1(62.92,33.27) v1(63.93,44.45) v1(63.93,43.43) v1(63.93,42.42) v1(63.93,41.4) v1(63.93,40.39) v1(63.93,39.37) v1(63.93,38.35) v1(63.93,37.34) v1(63.93,36.32) v1(63.93,35.31) v1(64.95,44.45) v1(64.95,43.43) v1(64.95,42.42) v1(64.95,41.4) v1(64.95,40.39) v1(64.95,39.37) v1(64.95,38.35) v1(64.95,37.34) v1(64.95,36.32) v1(64.95,35.31) v1(65.96,44.45) v1(65.96,43.43) v1(65.96,42.42) v1(65.96,41.4) v1(65.96,40.39) v1(65.96,39.37) v1(65.96,38.35) v1(65.96,37.34) v1(65.96,36.32) v2(47.88,40.26) v2(47.88,39.24) v2(47.88,38.23) v2(47.88,37.21) v2(48.9,40.26) v2(48.9,39.24) v2(48.9,38.23) v2(48.9,37.21) v2(49.91,40.26) v2(49.91,39.24) v2(49.91,38.23) v2(49.91,37.21) v2(50.93,40.26) v2(50.93,39.24) v2(50.93,38.23) v2(50.93,37.21) v2(51.94,40.26) v2(51.94,39.24) v2(51.94,38.23) v2(51.94,37.21)
$1N8888: length 1.8
  Top Layer w0.381: U1.4 9.49,30.73 R2.2
$1N9180: length 9.4
  Top Layer w0.508: v1(2.45,30.19) 3.21,29.42 U1.6
  Bottom Layer w0.381: v1(2.45,30.19) 2.41,30.22 2.41,31.62 3.26,32.47 v1(7.98,32.47)
$1N9267: length 1.8
  Top Layer w0.508: C1.1 2.45,28.15 U1.7
$1N9342:
  vias: v1(2.03,26.92) v1(2.03,25.91) v1(2.03,24.89) v1(3.05,25.91) v1(3.05,24.89) v1(3.09,26.92) v2(1.46,23.88) v2(1.46,20.83) v2(2.48,23.88) v2(2.48,22.86) v2(2.48,20.83) v2(3.5,23.88) v2(3.5,22.86) v2(3.5,20.83)
$1N9435: length 3.5
  Top Layer w0.254: R1.1 4.03,32.48 4.04,32.47 4.13,32.39 U1.5
$1N23526: length 2
  Top Layer w0.254: R5.1 22.82,1.91 LED1.1
$1N37471:
  vias: v1(10.54,40.89) v1(12.57,40.89) v1(13.59,40.89) v1(13.59,39.88) v1(13.59,38.86) v1(14.61,40.89) v1(14.61,39.88) v1(14.61,38.86)
$2N765: length 9.5
  Top Layer w0.254: v1(28.32,26.68) 27.46,25.82 D6.2 ; v1(32.38,22.73) 32.89,23.24 32.89,24.11
  Bottom Layer w0.254: v1(28.32,26.68) 32.27,22.73 v1(32.38,22.73)
$2N797: length 22.6
  Top Layer w0.254: v1(24,42.04) 24.87,42.04 ; v1(28.32,28.19) 27.46,29.04 D6.1
  Bottom Layer w0.254: v1(28.32,28.19) 23.63,28.19 22.73,29.08 22.73,40.77 v1(24,42.04)
$2N1199: length 4.2
  Top Layer w0.254: 35.43,24.11 35.91,24.11 R15.1 38.14,25.15 D7.2
$2N1218: length 5.8
  Top Layer w0.254: Q3.4 36.95,28.66 R15.2 38.21,26.65 38.86,27.31 D7.1
$2N1738: length 2.2
  Top Layer w0.635: D4.2 27.01,23.42 U8.2
$2N2512: length 10.1
  Top Layer w0.254: 54.23,26.04 55.47,26.04 D9.2 ; 54.23,26.04 R17.1 ; 54.23,26.04 54.23,23.88 53.47,23.11 50.93,23.11 50.42,23.62 U11.7
$2N2535: length 5.8
  Top Layer w0.254: D10.1 42.26,26.66 R18.2 44.43,27.91 Q5.4
$2N2547: length 14.5
  Top Layer w0.254: v1(52.96,23.88) U11.5 ; v1(43.18,24) R18.1 42,25.15 D10.2
  Bottom Layer w0.254: v1(52.96,23.88) 52.58,23.5 43.69,23.5 v1(43.18,24)
$2N2553: length 25.4
  Top Layer w0.254: R17.2 54.52,28.31 v1(55.49,29.29) ; v1(48.01,43.94) Q4.4
  Bottom Layer w0.254: v1(48.01,43.94) 54.1,43.94 55.88,42.16 55.88,29.72 55.5,29.34
$2N2559: length 2.2
  Top Layer w0.635: U10.2 44.54,24.31 D8.2
$2N7408: length 8.4
  Inner2 w0.508: 35.12,31.5 34.54,30.92 34.48,30.92 33.91,31.5
  Inner2 w0.762: 34.54,32.64 v1(34.54,27.18) v1(34.54,26.54) v1(34.54,25.91)
  vias: v2(30.35,46.23) v2(30.35,45.21) v2(30.35,44.2) v2(30.35,43.18) v2(30.35,42.16) v2(30.35,41.15) v2(30.35,40.13) v2(31.37,46.23) v2(31.37,45.21) v2(31.37,44.2) v2(31.37,43.18) v2(31.37,42.16) v2(31.37,41.15) v2(31.37,40.13) v2(32.13,34.92) v2(32.13,33.91) v2(32.13,32.89) v2(32.13,31.88) v2(32.38,46.23) v2(32.38,45.21) v2(32.38,44.2) v2(32.38,43.18) v2(32.38,42.16) v2(32.38,41.15) v2(32.38,40.13) v2(33.15,34.92) v2(33.15,33.91) v2(33.15,32.89) v2(33.15,31.88) v2(33.4,46.23) v2(33.4,45.21) v2(33.4,44.2) v2(33.4,43.18) v2(33.4,42.16) v2(33.4,41.15) v2(33.4,40.13) v2(34.16,34.92) v2(34.16,33.91) v2(34.16,32.89) v2(34.16,31.88) v2(34.42,46.23) v2(34.42,45.21) v2(34.42,44.2) v2(34.42,43.18) v2(34.42,42.16) v2(34.42,41.15) v2(34.42,40.13) v2(35.18,34.92) v2(35.18,33.91) v2(35.18,32.89) v2(35.18,31.88) v2(36.19,34.92) v2(36.19,33.91) v2(36.19,32.89) v2(36.19,31.88)
$2N7455: length 21.8
  Inner2 w0.508: 43.81,31.5 43.2,30.89 43.16,30.89 42.54,31.5
  Inner2 w0.762: 43.18,33.27 43.18,25.55 44.72,24 50.15,24 51.27,25.12 51.27,28.19
  vias: v1(51.31,28.07) v1(51.31,27.43) v1(51.31,26.8) v2(40.51,34.92) v2(40.51,33.91) v2(40.51,32.89) v2(40.51,31.88) v2(41.53,34.92) v2(41.53,33.91) v2(41.53,32.89) v2(41.53,31.88) v2(42.04,46.1) v2(42.04,45.08) v2(42.04,44.07) v2(42.04,43.05) v2(42.04,42.04) v2(42.04,41.02) v2(42.04,40) v2(42.54,34.92) v2(42.54,33.91) v2(42.54,32.89) v2(42.54,31.88) v2(43.05,46.1) v2(43.05,45.08) v2(43.05,44.07) v2(43.05,43.05) v2(43.05,42.04) v2(43.05,41.02) v2(43.05,40) v2(43.56,34.92) v2(43.56,33.91) v2(43.56,32.89) v2(43.56,31.88) v2(44.07,46.1) v2(44.07,45.08) v2(44.07,44.07) v2(44.07,43.05) v2(44.07,42.04) v2(44.07,41.02) v2(44.07,40) v2(44.58,34.92) v2(44.58,33.91) v2(44.58,32.89) v2(44.58,31.88) v2(45.09,46.1) v2(45.09,45.08) v2(45.09,44.07) v2(45.09,43.05) v2(45.09,42.04) v2(45.09,41.02) v2(45.09,40) v2(46.1,46.1) v2(46.1,45.08) v2(46.1,44.07) v2(46.1,43.05) v2(46.1,42.04) v2(46.1,41.02) v2(46.1,40)
$2N11333: length 2.6
  Top Layer w0.254: Q2.4 58.14,27.15 57.78,26.8 R16.2
$2N27874: length 4
  Top Layer w0.635: C25.2 30.39,25.64 D4.1 31.47,24.26 31.62,24.11
$2N27929: length 3.8
  Top Layer w0.635: U11.8 48.07,24.87 D8.1 47.92,27.29 C28.2

## Copper pours and planes (outline as drawn; the poured copper is in the pictures)
3V3 on Top Layer: 13.59,4.19 21.49,4.19 21.49,0.76 13.59,0.76
3V3 on Top Layer: 36.7,14.48 38.48,14.48 38.48,13.21 36.7,13.21
3V3 on Top Layer: 32.89,3.69 35.69,3.69 35.69,2.29 32.89,2.29
3V3 on Inner2: 15.07,4.25 35.77,4.25 35.77,2.09 15.07,2.09
3V3 on Inner2: 36.51,13.71 49,13.71 49,1.17 36.51,1.17
3V3 on Inner2: 35.05,14.55 37.97,14.55 37.97,2.09 35.05,2.09
3V3A on Top Layer: 18.41,9.14 24.64,9.14 24.64,6.35 18.41,6.35
3V3A on Inner2: 19.86,8.77 23.19,8.77 23.19,6.61 19.86,6.61
4V8 on Top Layer: 25.02,23.11 31.96,23.11 31.96,17.14 25.02,17.14
4V8 on Top Layer: 42.69,23.75 49.63,23.75 49.63,18.8 42.69,18.8
4V8 on Top Layer: 10.92,5.74 12.64,5.74 12.64,2.79 10.92,2.79
4V8 on Top Layer: 7.62,24.34 18.07,24.34 18.07,16.76 7.62,16.76
4V8 on Inner2: 10.76,9.91 16.38,9.91 16.38,3.81 10.76,3.81
4V8 on Inner2: 7.62,24.34 19.24,24.34 19.24,16.76 7.62,16.76
4V8 on Inner2: 13.33,20.83 17.12,20.83 17.12,9.27 13.33,9.27
AGND on Top Layer: 6.22,10.03 5.84,9.65 5.84,7.62 6.35,7.11 20.89,7.11 22.86,5.14 37.53,5.14 37.85,5.46 37.85,11.75 37.29,12.3 35.71,12.3 35.43,12.57 21.72,12.57 20.57,11.43 12.7,11.43 11.3,10.03
AGND on Bottom Layer: 6.22,10.03 5.84,9.65 5.84,7.62 6.35,7.11 20.89,7.11 22.86,5.14 37.53,5.14 37.85,5.46 37.85,11.75 37.29,12.3 35.71,12.3 35.43,12.57 21.72,12.57 20.57,11.43 12.7,11.43 11.3,10.03
AGND on Inner1: 6.22,10.03 5.84,9.65 5.84,7.62 6.35,7.11 20.89,7.11 22.86,5.14 37.53,5.14 37.85,5.46 37.85,11.75 37.29,12.3 35.71,12.3 35.43,12.57 21.72,12.57 20.57,11.43 12.7,11.43 11.3,10.03
GND on Top Layer: -0.42,10.03 -0.8,9.63 -0.8,1.43 1.27,-0.63 79.38,-0.63 81.03,1.02 81.03,22.86 80.39,23.5 70.99,23.5 64.64,17.14 36.58,17.14 35.18,15.75 35.18,13.27 36.05,12.45 37.41,12.45 38.04,11.81 38.04,5.31 37.68,4.95 22.9,4.95 20.82,6.86 5.97,6.86 5.21,7.54 5.21,9.53 4.7,10.03
GND on Bottom Layer: -0.42,10.03 -0.8,9.63 -0.8,1.43 1.27,-0.63 79.38,-0.63 81.03,1.02 81.03,22.86 80.39,23.5 70.99,23.5 64.64,17.14 36.58,17.14 35.18,15.75 35.18,13.27 36.05,12.45 37.41,12.45 38.04,11.81 38.04,5.31 37.68,4.95 22.9,4.95 20.82,6.86 5.97,6.86 5.21,7.54 5.21,9.53 4.7,10.03
GND on Inner1: -0.42,10.03 -0.8,9.63 -0.8,1.43 1.27,-0.63 79.38,-0.63 81.03,1.02 81.03,22.86 80.39,23.5 70.99,23.5 64.64,17.14 36.58,17.14 35.18,15.75 35.18,13.27 36.05,12.45 37.41,12.45 38.04,11.81 38.04,5.31 37.68,4.95 22.9,4.95 20.82,6.86 5.97,6.86 5.21,7.54 5.21,9.53 4.7,10.03
PGND on Top Layer: 12.32,11.3 12.7,11.68 20.45,11.68 21.59,12.83 34.58,12.83 34.96,13.21 34.96,15.91 36.45,17.4 64.52,17.4 70.87,23.75 80.52,23.75 81.15,24.38 81.15,49.66 79.76,51.05 1.14,51.05 -0.89,49.02 -0.89,11.8 -0.42,11.3
PGND on Bottom Layer: 12.32,11.3 12.7,11.68 20.45,11.68 21.59,12.83 34.58,12.83 34.96,13.21 34.96,15.91 36.45,17.4 64.52,17.4 70.87,23.75 80.52,23.75 81.15,24.38 81.15,49.66 79.76,51.05 1.14,51.05 -0.89,49.02 -0.89,11.8 -0.42,11.3
PGND on Inner1: 12.32,11.3 12.7,11.68 20.45,11.68 21.59,12.83 34.58,12.83 34.96,13.21 34.96,15.91 36.45,17.4 64.52,17.4 70.87,23.75 80.52,23.75 81.15,24.38 81.15,49.66 79.76,51.05 1.14,51.05 -0.89,49.02 -0.89,11.8 -0.42,11.3
VIN on Top Layer: 8.53,40.89 30.86,40.89 30.86,27.52 8.53,27.52
VIN on Inner2: 8.53,40.89 30.86,40.89 30.86,27.52 8.53,27.52
VLOAD on Top Layer: 67.82,34.04 72.9,34.04 72.9,22.61 67.82,22.61
VLOAD on Top Layer: 66.93,44.7 72.14,44.7 72.14,32.13 66.93,32.13
VLOAD on Inner2: 66.93,44.7 72.14,44.7 72.14,32.13 66.93,32.13
VLOAD on Inner2: 67.82,34.04 72.9,34.04 72.9,22.61 67.82,22.61
VOUT on Top Layer: 45.56,45.59 66.42,45.59 66.42,32.89 45.56,32.89
$1N9342 on Top Layer: 1.27,27.43 4.95,27.43 4.95,20.32 1.27,20.32
$1N9342 on Inner2: 1.27,27.43 4.95,27.43 4.95,20.32 1.27,20.32
$1N37471 on Top Layer: 9.53,41.66 16,41.66 16,37.85 9.53,37.85
$1N37471 on Inner2: 9.53,41.66 16,41.66 16,37.85 9.53,37.85
$2N7408 on Top Layer: 33.74,27.69 35.46,27.69 35.46,23.21 33.74,23.21
$2N7408 on Top Layer: 25.53,46.74 36.7,46.74 36.7,31.24 25.53,31.24
$2N7408 on Inner2: 25.53,46.74 36.7,46.74 36.7,31.24 25.53,31.24
$2N7455 on Top Layer: 50.38,28.45 52.22,28.45 52.22,23.97 50.38,23.97
$2N7455 on Top Layer: 40.04,47.77 52.36,47.77 52.36,31.26 40.04,31.26
$2N7455 on Inner2: 40.04,47.77 52.36,47.77 52.36,31.26 40.04,31.26
$2N14237 on Top Layer: 59.06,26.42 64.77,26.42 64.77,22.76 59.06,22.76

Small or netless copper shapes (teardrops, artwork), in the pictures only: 138 on Top Layer, 42 on Bottom Layer, 8 on Inner2

## Text on the board
Bottom Silkscreen Layer: 队伍:此方 | D题 数控电源 | 2024华工增芯杯
